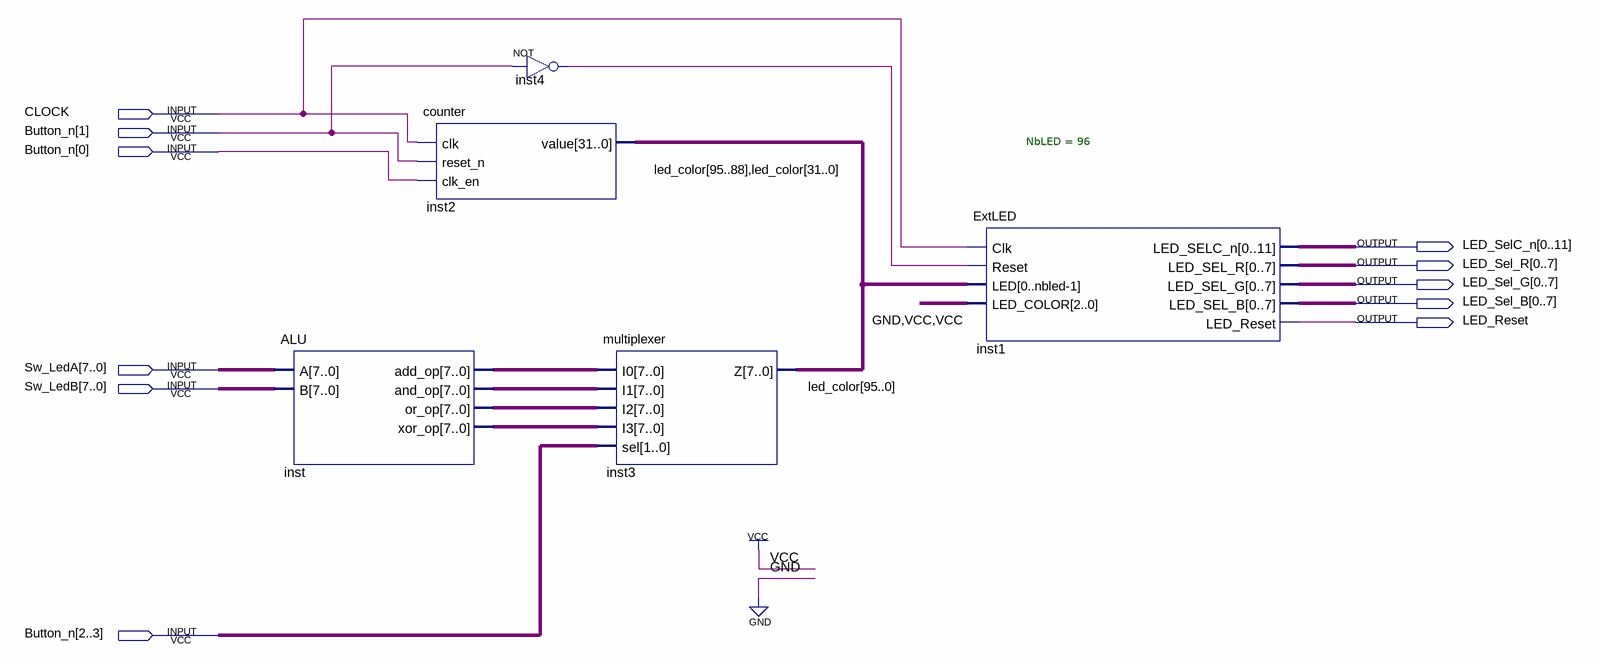
[diagram p0: schematic sheet]
// Quartus schematic Tutorial.bdf as structural Verilog: 5 symbols, 11 pins
module Tutorial (
  input  CLOCK,
  input  [0:3] Button_n,
  input  [7:0] Sw_LedA,
  input  [7:0] Sw_LedB,
  output [0:11] LED_SelC_n,
  output [0:7] LED_Sel_R,
  output [0:7] LED_Sel_G,
  output [0:7] LED_Sel_B,
  output LED_Reset
);

  wire inst4_out;
  wire [7:0] inst_add_op, inst_and_op, inst_or_op, inst_xor_op;
  wire [95:0] led_color;

  ALU inst (
    .A(Sw_LedA), .B(Sw_LedB), .add_op(inst_add_op), .and_op(inst_and_op), .or_op(inst_or_op),
    .xor_op(inst_xor_op));
  counter inst2 (.clk(CLOCK), .reset_n(Button_n[1]), .clk_en(Button_n[0]), .value({led_color[95:88], led_color[31:0]}));
  not inst4 (inst4_out, Button_n[1]);
  multiplexer inst3 (
    .I0(inst_add_op), .I1(inst_and_op), .I2(inst_or_op), .I3(inst_xor_op), .sel(Button_n[2:3]), .Z(led_color));
  ExtLED #(.NbLED(96)) inst1 (
    .Clk(CLOCK), .Reset(inst4_out), .LED(led_color), .LED_COLOR(3'b011), .LED_SELC_n(LED_SelC_n),
    .LED_SEL_R(LED_Sel_R), .LED_SEL_G(LED_Sel_G), .LED_SEL_B(LED_Sel_B), .LED_Reset(LED_Reset));
endmodule
